# EAGLE schematic ospi_v13 (EAGLE 6.5.0)
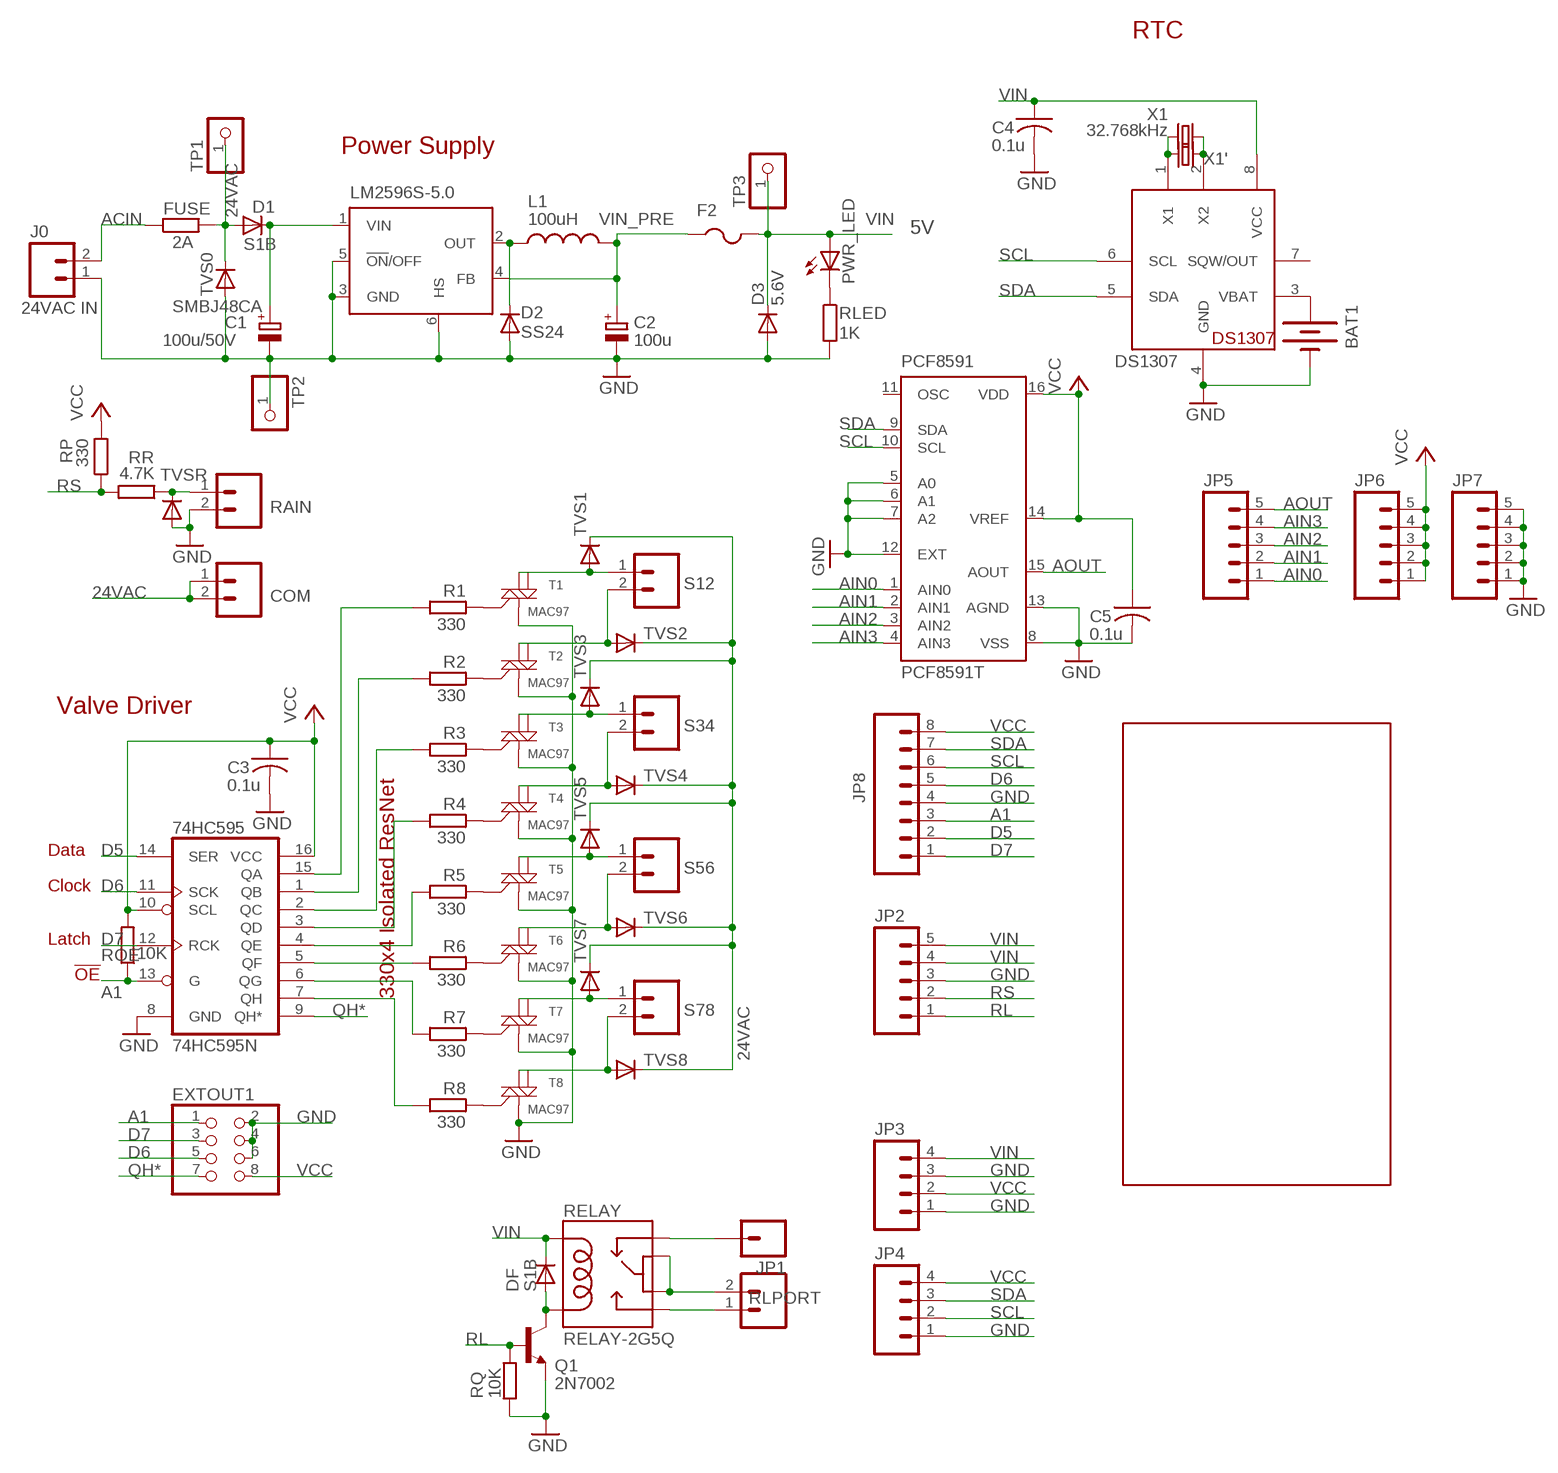
[diagram p0: schematic, sheet 1]

## Parts
74HC595  74HC595N  74LS595D  [SO16]
BAT1  BATTERYBATTERY_12MM_SMT  [BATTCON_12MM_SMT]
C1  100u/50V  CPOL-EUE  [PANASONIC_E]
C2  100u  CPOL-EUE  [PANASONIC_E]
C3  0.1u  C-USC0805K  [C0805K]
C4  0.1u  C-USC0805K  [C0805K]
C5  0.1u  C-USC0805K  [C0805K]
COM  M025MM-X  [SCREWTERMINAL-5MM-2-X]
D1  S1B  DIODE-DO-214AC  [DO-214AC]
D2  SS24  DIODE-DO-214AC  [DO-214AC]
D3  5.6V  DIODE-MINIMELF  [MINIMELF]
DF  S1B  DIODE-DO-214AC  [DO-214AC]
DS1307  DS1307  DS1307SOIC  [SO08]
EXTOUT1  PINHD-2X4/90  [2X04/90]
F2  PTCFUSE-1812  [1812]
FUSE  2A  R-EU_0411/15  [0411/15]
J0  24VAC IN  M024MM-X  [SCREWTERMINAL-4MM-2-X]
JP1  M01PTH  [1X01]
JP2  M05LOCK  [1X05_LOCK]
JP3  M04LOCK  [1X04_LOCK]
JP4  M04LOCK  [1X04_LOCK]
JP5  M05LOCK  [1X05_LOCK]
JP6  M05LOCK  [1X05_LOCK]
JP7  M05LOCK  [1X05_LOCK]
JP8  M08LOCK  [1X08_LOCK]
L1  100uH  INDUCTORPWR  [CDRH125]
LM2596S-5.0  LM2596S  [TO263-5]
PCF8591  PCF8591T  [SO16W]
PWR_LED  LEDCHIPLED_0805  [CHIPLED_0805]
Q1  2N7002  TRANSISTOR_NPNSOT23-3  [SOT23-3]
R1  330  R-EU_R0805  [R0805]
R2  330  R-EU_R0805  [R0805]
R3  330  R-EU_R0805  [R0805]
R4  330  R-EU_R0805  [R0805]
R5  330  R-EU_R0805  [R0805]
R6  330  R-EU_R0805  [R0805]
R7  330  R-EU_R0805  [R0805]
R8  330  R-EU_R0805  [R0805]
RAIN  M025MM-X  [SCREWTERMINAL-5MM-2-X]
RELAY  RELAY-2G5Q  [RELAY-G5V]
RLED  1K  R-EU_R0805  [R0805]
RLPORT  M025MM  [SCREWTERMINAL-5MM-2]
ROE  10K  R-EU_R0805  [R0805]
RP  330  R-EU_R0805  [R0805]
RQ  10K  R-EU_R0805  [R0805]
RR  4.7K  R-EU_R0805  [R0805]
S12  M025MM-X  [SCREWTERMINAL-5MM-2-X]
S34  M025MM-X  [SCREWTERMINAL-5MM-2-X]
S56  M025MM-X  [SCREWTERMINAL-5MM-2-X]
S78  M025MM-X  [SCREWTERMINAL-5MM-2-X]
T1  MAC97  MAC97SOT223  [SOT223]
T2  MAC97  MAC97SOT223  [SOT223]
T3  MAC97  MAC97SOT223  [SOT223]
T4  MAC97  MAC97SOT223  [SOT223]
T5  MAC97  MAC97SOT223  [SOT223]
T6  MAC97  MAC97SOT223  [SOT223]
T7  MAC97  MAC97SOT223  [SOT223]
T8  MAC97  MAC97SOT223  [SOT223]
TP1  PINHD-1X1CB  [1X01-CLEANBIG]
TP2  PINHD-1X1CB  [1X01-CLEANBIG]
TP3  PINHD-1X1CB  [1X01-CLEANBIG]
TVS0  SMBJ48CA  DIODE-SMB  [SMB]
TVS1  DIODE-SMB  [SMB]
TVS2  DIODE-SMB  [SMB]
TVS3  DIODE-SMB  [SMB]
TVS4  DIODE-SMB  [SMB]
TVS5  DIODE-SMB  [SMB]
TVS6  DIODE-SMB  [SMB]
TVS7  DIODE-SMB  [SMB]
TVS8  DIODE-SMB  [SMB]
TVSR  DIODE-SMB  [SMB]
U$2  OSPI  [OSPI]
X1  32.768kHz  CRYSTALMM20SS  [MM20SS]
X1'  32.768kHz  CRYSTALTC38H  [TC38H]

## Nets
24VAC [power]: COM.1 COM.2 D1.A FUSE.2 TP1.1 TVS0.C TVS1.C TVS2.C TVS3.C TVS4.C TVS5.C TVS6.C TVS7.C TVS8.C
A1: 74HC595.13(G) EXTOUT1.1 JP8.3 ROE.1
ACIN [power]: FUSE.1 J0.2
AIN0: JP5.1 PCF8591.1(AIN0)
AIN1: JP5.2 PCF8591.2(AIN1)
AIN2: JP5.3 PCF8591.3(AIN2)
AIN3: JP5.4 PCF8591.4(AIN3)
AOUT: JP5.5 PCF8591.15(AOUT)
CO [power]: RELAY.5 RELAY.6 RLPORT.2
D5: 74HC595.14(SER) JP8.2
D6: 74HC595.11(SCK) EXTOUT1.5 JP8.5
D7: 74HC595.12(RCK) EXTOUT1.3 JP8.1
GND [power]: 74HC595.8(GND) BAT1.P$1(-) C1.- C2.- C3.2 C4.2 C5.2 D2.A D3.A DS1307.4(GND) EXTOUT1.2 EXTOUT1.4 EXTOUT1.6 J0.1 JP2.3 JP3.1 JP3.3 JP4.1 JP7.1 JP7.2 JP7.3 JP7.4 JP7.5 JP8.4 LM2596S-5.0.3(GND) LM2596S-5.0.5(!ON!/OFF) LM2596S-5.0.6(HS) PCF8591.5(A0) PCF8591.6(A1) PCF8591.7(A2) PCF8591.8(VSS) PCF8591.12(EXT) PCF8591.13(AGND) Q1.2(E) RAIN.2 RLED.2 RQ.2 T1.1(M1) T2.1(M1) T3.1(M1) T4.1(M1) T5.1(M1) T6.1(M1) T7.1(M1) T8.1(M1) TP2.1 TVS0.A TVSR.A
N$1: PWR_LED.C RLED.1
N$2 [power]: C1.+ D1.C LM2596S-5.0.1(VIN)
N$3: R1.2 T1.3(G)
N$4: 74HC595.5(QF) R6.1
N$5: 74HC595.6(QG) R7.1
N$7: 74HC595.7(QH) R8.1
N$8 [power]: D2.C L1.1 LM2596S-5.0.2(OUT)
N$9: DS1307.1(X1) X1'.2 X1.1
N$10: 74HC595.4(QE) R5.1
N$11: 74HC595.3(QD) R4.1
N$12: 74HC595.2(QC) R3.1
N$13: 74HC595.1(QB) R2.1
N$14: 74HC595.15(QA) R1.1
N$15: R2.2 T2.3(G)
N$16 [power]: S12.1 T1.2(M2) TVS1.A
N$17 [power]: S12.2 T2.2(M2) TVS2.A
N$18 [power]: S34.1 T3.2(M2) TVS3.A
N$19: R3.2 T3.3(G)
N$20 [power]: S34.2 T4.2(M2) TVS4.A
N$21: R4.2 T4.3(G)
N$22 [power]: S56.1 T5.2(M2) TVS5.A
N$23 [power]: S56.2 T6.2(M2) TVS6.A
N$24 [power]: S78.1 T7.2(M2) TVS7.A
N$25 [power]: S78.2 T8.2(M2) TVS8.A
N$26: R5.2 T5.3(G)
N$27: R6.2 T6.3(G)
N$28: R7.2 T7.3(G)
N$29: R8.2 T8.3(G)
N$30: DS1307.2(X2) X1'.1 X1.4
N$31: RAIN.1 RR.1 TVSR.C
N$36: BAT1.P$2(+) DS1307.3(VBAT)
N$77 [power]: DF.A Q1.3(C) RELAY.9
NC [power]: JP1.1 RELAY.1
NO [power]: RELAY.10 RLPORT.1
QH*: 74HC595.9(QH*) EXTOUT1.7
RL: JP2.1 Q1.1(B) RQ.1
RS: JP2.2 RP.1 RR.2
SCL: DS1307.6(SCL) JP4.2 JP8.6 PCF8591.10(SCL)
SDA: DS1307.5(SDA) JP4.3 JP8.7 PCF8591.9(SDA)
VCC: 74HC595.10(SCL) 74HC595.16(VCC) C3.1 C5.1 EXTOUT1.8 JP3.2 JP4.4 JP6.1 JP6.2 JP6.3 JP6.4 JP6.5 JP8.8 PCF8591.14(VREF) PCF8591.16(VDD) ROE.2 RP.2
VIN [power]: C4.1 D3.C DF.C DS1307.8(VCC) F2.2 JP2.4 JP2.5 JP3.4 PWR_LED.A RELAY.2 TP3.1
VIN_PRE [power]: C2.+ F2.1 L1.2 LM2596S-5.0.4(FB)
Unconnected: DS1307.7(SQW/OUT) PCF8591.11(OSC) T1.4(M2-4) T2.4(M2-4) T3.4(M2-4) T4.4(M2-4) T5.4(M2-4) T6.4(M2-4) T7.4(M2-4) T8.4(M2-4)

## Notes on the sheet
- RTC
- Power Supply
- 5V
- Valve Driver
- Data
- Clock
- Latch
- !OE
- 330x4 Isolated ResNet

## Library data of the parts
74HC595 = SparkFun:74*595: 8-bit SHIFT REGISTER, output latch
BAT1 = SparkFunNew:BATTERY: Battery Holders Various common sizes : AA, AAA, 20mm coin cell and 12mm coin cell.
C1 C2 = resistor:CPOL-EU: POLARIZED CAPACITOR, European symbol
C3-C5 = adafruit:C-US: CAPACITOR, American symbol
COM J0 RAIN RLPORT S12 S34 S56 S78 = SparkFun:M02: Header 2 Standard 2-pin 0.1" header. Use with straight break away headers (SKU : PRT-00116), right angle break away headers (PRT-00553), swiss pins (PRT-00743), machine pins (PRT-00117), and female headers (PRT-00115). Molex polarized connector foot print use with SKU : PRT-08233 with associated crimp pins and housings.
D1-D3 DF TVS0 TVS1-TVS8 TVSR = diode:DIODE-: DIODE
DS1307 = adafruit:DS1307: DS1307 Real time clock (RTC) with battery backup ability. Talk to it via i2c
EXTOUT1 = pinhead:PINHD-2X4: PIN HEADER
F2 = adafruit:PTCFUSE: PTC fuses, resettable thermistors
FUSE R1-R8 RLED ROE RP RQ RR = rcl:R-EU_: RESISTOR, European symbol
JP1 = SparkFun:M01: Header 1 Standard 1-pin 0.1" header. Use with straight break away headers (SKU : PRT-00116), right angle break away headers (PRT-00553), swiss pins (PRT-00743), machine pins (PRT-00117), and female headers (PRT-00115).
JP2 JP5-JP7 = SparkFun:M05: Header 5 Standard 5-pin 0.1" header. Use with straight break away headers (SKU : PRT-00116), right angle break away headers (PRT-00553), swiss pins (PRT-00743), machine pins (PRT-00117), and female headers (PRT-00115). Molex polarized connector foot print use with SKU : PRT-08230 with associated crimp pins and housings.
JP3 JP4 = SparkFun:M04: Header 4 Standard 4-pin 0.1" header. Use with straight break away headers (SKU : PRT-00116), right angle break away headers (PRT-00553), swiss pins (PRT-00743), machine pins (PRT-00117), and female headers (PRT-00115). Molex polarized connector foot print use with SKU : PRT-08231 with associated crimp pins and housings.
JP8 = SparkFun:M08: Header 8 Standard 8-pin 0.1" header. Use with straight break away headers (SKU : PRT-00116), right angle break away headers (PRT-00553), swiss pins (PRT-00743), machine pins (PRT-00117), and female headers (PRT-00115).
L1 = SparkFunNew:INDUCTOR: Inductors Basic Inductor/Choke - 0603 and 1206. Footprints are not proven and vary greatly between part numbers.
LM2596S-5.0 = national-semiconductor:LM2596: SIMPLE SWITCHER® Power Converter 150 kHz 3A Step-Down Voltage Regulator Source: http://www.national.com/ds/LM/LM2596.pdf; MF: NATIONAL SEMICONDUCTOR; MPN: LM2596S-ADJ/NOPB; OC_FARNELL: 9494367; OC_NEWARK: 41K3842
PCF8591 = micro-philips:PCF8591: I2C-Bus D/A CONVERTER; MPN: PCF8591T/2,512; OC_FARNELL: 1826767; OC_NEWARK: 70R6911
PWR_LED = adafruit:LED: LED OSRAM: - CHIPLED LG R971, LG N971, LY N971, LG Q971, LY Q971, LO R971, LY R971 LH N974, LH R974 LS Q976, LO Q976, LY Q976 LO Q996 - Hyper CHIPLED LW Q18S LB Q993, LB Q99A, LB R99A - SideLED LS A670, LO A670, LY A670, LG A670, LP A670 LB A673, LV A673, LT A673, LW A673 LH A674 LY A675 LS A676, LA A676, LO A676, LY A676, LW A676 LS A679, LY A679, LG A679 - Hyper Micro SIDELED® LS Y876, LA Y876, LO Y876, LY Y876 LT Y87S - SmartLED LW L88C, LW L88S LB L89C, LB L89S, LG L890 LS L89K, LO L89K, LY L89K LS L896, LA L896, LO L896, LY L896 - TOPLED LS T670, LO T670, LY T670, LG T670, LP T670 LSG T670, LSP T670, LSY T670, LOP T670, LYG T670 LG T671, LOG T671, LSG T671 LB T673, LV T673, LT T673, LW T673 LH T674 LS T676, LA T676, LO T676, LY T676, LB T676, LH T676, LSB T676, LW T676 LB T67C, LV T67C, LT T67C, LS T67K, LO T67K, LY T67K, LW E67C LS E67B, LA E67B, LO E67B, LY E67B, LB E67C, LV E67C, LT E67C LW T67C LS T679, LY T679, LG T679 LS T770, LO T770, LY T770, LG T770, LP T770 LB T773, LV T773, LT T773, LW T773 LH T774 LS E675, LA E675, LY E675, LS T675 LS T776, LA T776, LO T776, LY T776, LB T776 LHGB T686 LT T68C, LB T68C - Hyper Mini TOPLED® LB M676 - Mini TOPLED Santana® LG M470 LS M47K, LO M47K, LY M47K Source: http://www.osram.convergy.de/
Q1 = SparkFunNew:TRANSISTOR_NPN: Transistor NPN BJT configuration in SOT23 package. MMBT2222 is the common NPN we use. Double check BCE configuration again layout.
RELAY = SparkFunNew:RELAY-2
T1-T8 = SparkFun:MAC97: MAC97 Triac http://www.onsemi.com/pub_link/Collateral/MAC97-D.PDF
TP1-TP3 = adafruit:PINHD-1X1: Pin header 1x1 for 0.1" spacing With round pins
U$2 = RaspberryPi:OSPI
X1 X1' = crystal:CRYSTAL: CRYSTAL; OC_FARNELL: unknown; OC_NEWARK: unknown

## Net classes
0 default: width 0.254 mm, clearance 0.203 mm
1 power: width 0.61 mm, clearance 0.203 mm